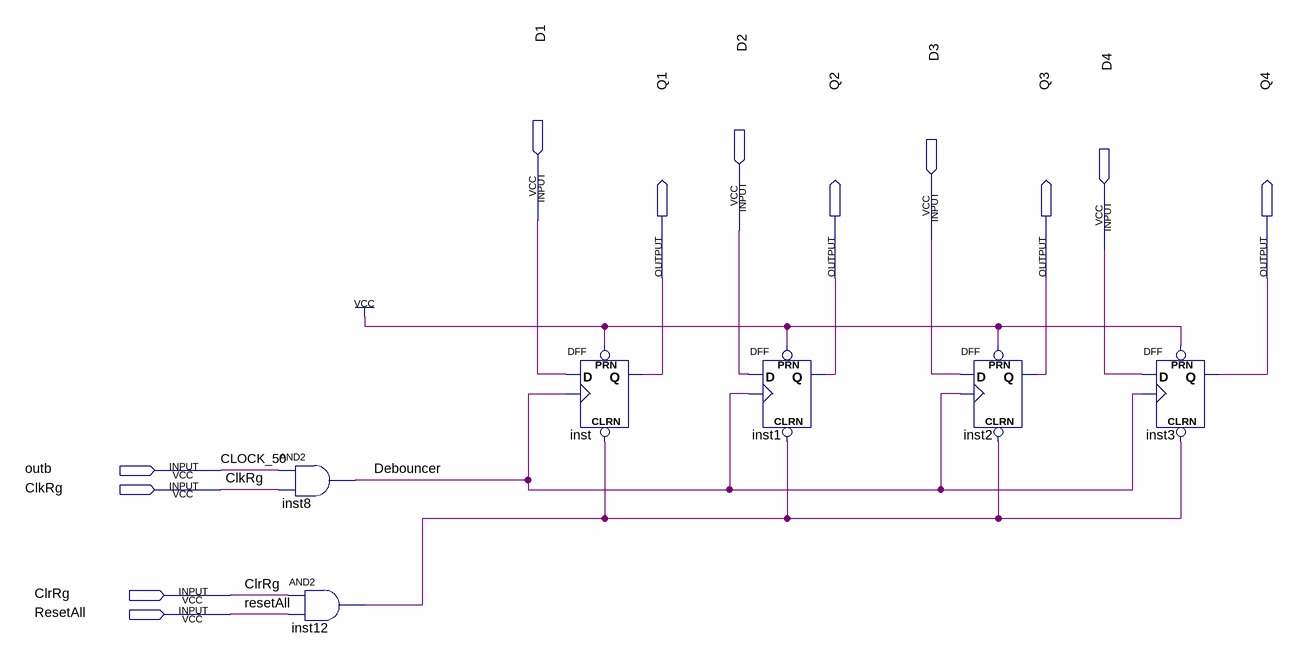
[diagram p0: schematic sheet]
// Quartus schematic Register.bdf as structural Verilog: 6 symbols, 12 pins
module Register (
  input  D1,
  input  D2,
  input  D3,
  input  D4,
  input  outb,
  input  ClkRg,
  input  ClrRg,
  input  ResetAll,
  output Q1,
  output Q2,
  output Q3,
  output Q4
);

  wire Debouncer, inst12_out;

  and inst8 (Debouncer, outb, ClkRg);
  and inst12 (inst12_out, ClrRg, ResetAll);
  DFF inst (.CLRN(inst12_out), .CLK(Debouncer), .D(D1), .PRN(1'b1), .Q(Q1));
  DFF inst1 (.CLRN(inst12_out), .CLK(Debouncer), .D(D2), .PRN(1'b1), .Q(Q2));
  DFF inst2 (.CLRN(inst12_out), .CLK(Debouncer), .D(D3), .PRN(1'b1), .Q(Q3));
  DFF inst3 (.CLRN(inst12_out), .CLK(Debouncer), .D(D4), .PRN(1'b1), .Q(Q4));

  // Other names for the same wires on the sheet: CLOCK_50 = outb
endmodule
